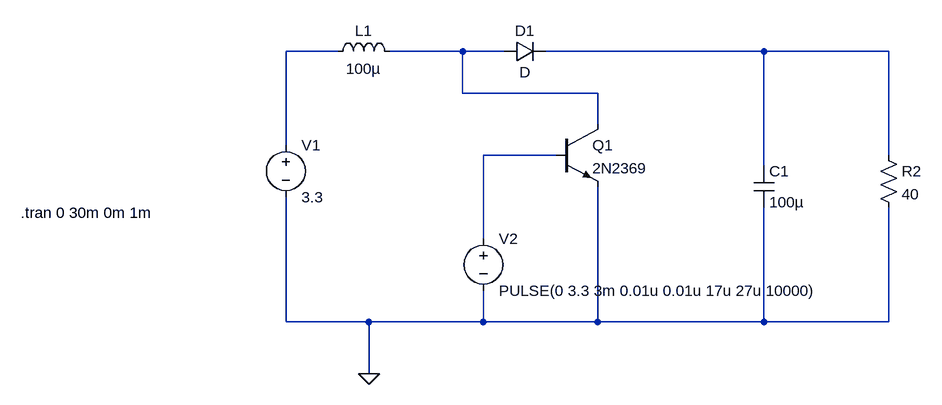
[diagram p0: schematic wzmacniacz33na72.asc]
wzmacniacz33na72.asc, the LTspice schematic file:
Version 4
SHEET 1 948 680
WIRE 16 -16 -64 -16
WIRE 208 -16 96 -16
WIRE 272 -16 208 -16
WIRE 672 -16 336 -16
WIRE 864 -16 672 -16
WIRE 208 48 208 -16
WIRE 416 48 208 48
WIRE 416 96 416 48
WIRE -64 128 -64 -16
WIRE 352 144 240 144
WIRE 864 144 864 -16
WIRE 672 160 672 -16
WIRE 240 272 240 144
WIRE -64 400 -64 208
WIRE 64 400 -64 400
WIRE 240 400 240 352
WIRE 240 400 64 400
WIRE 416 400 416 192
WIRE 416 400 240 400
WIRE 672 400 672 224
WIRE 672 400 416 400
WIRE 864 400 864 224
WIRE 864 400 672 400
WIRE 64 480 64 400
FLAG 64 480 0
SYMBOL voltage -64 112 R0
WINDOW 123 0 0 Left 0
WINDOW 39 0 0 Left 0
SYMATTR InstName V1
SYMATTR Value 3.3
SYMBOL voltage 240 256 R0
WINDOW 123 0 0 Left 0
WINDOW 39 0 0 Left 0
SYMATTR InstName V2
SYMATTR Value PULSE(0 3.3 3m 0.01u 0.01u 17u 27u 10000)
SYMBOL npn 352 96 R0
SYMATTR InstName Q1
SYMATTR Value 2N2369
SYMBOL diode 272 0 R270
WINDOW 0 32 32 VTop 2
WINDOW 3 0 32 VBottom 2
SYMATTR InstName D1
SYMBOL cap 656 160 R0
SYMATTR InstName C1
SYMATTR Value 100µ
SYMBOL res 848 128 R0
SYMATTR InstName R2
SYMATTR Value 40
SYMBOL ind 0 0 R270
WINDOW 0 32 56 VTop 2
WINDOW 3 5 56 VBottom 2
SYMATTR InstName L1
SYMATTR Value 100µ
TEXT -472 232 Left 2 !.tran 0 30m 0m 1m

The netlist it stands for:
* wzmacniacz33na72.asc
V1 N001 0 3.3
V2 N004 0 PULSE(0 3.3 3m 0.01u 0.01u 17u 27u 10000)
Q1 N002 N004 0 0 2N2369
D1 N002 N003 D
C1 N003 0 100µ
R2 N003 0 40
L1 N001 N002 100µ
.model D D
.lib standard.dio
.model NPN NPN
.model PNP PNP
.lib standard.bjt
.tran 0 30m 0m 1m
.backanno
.end